# Altium schematic sheet Power_toll.SchDoc
size A2
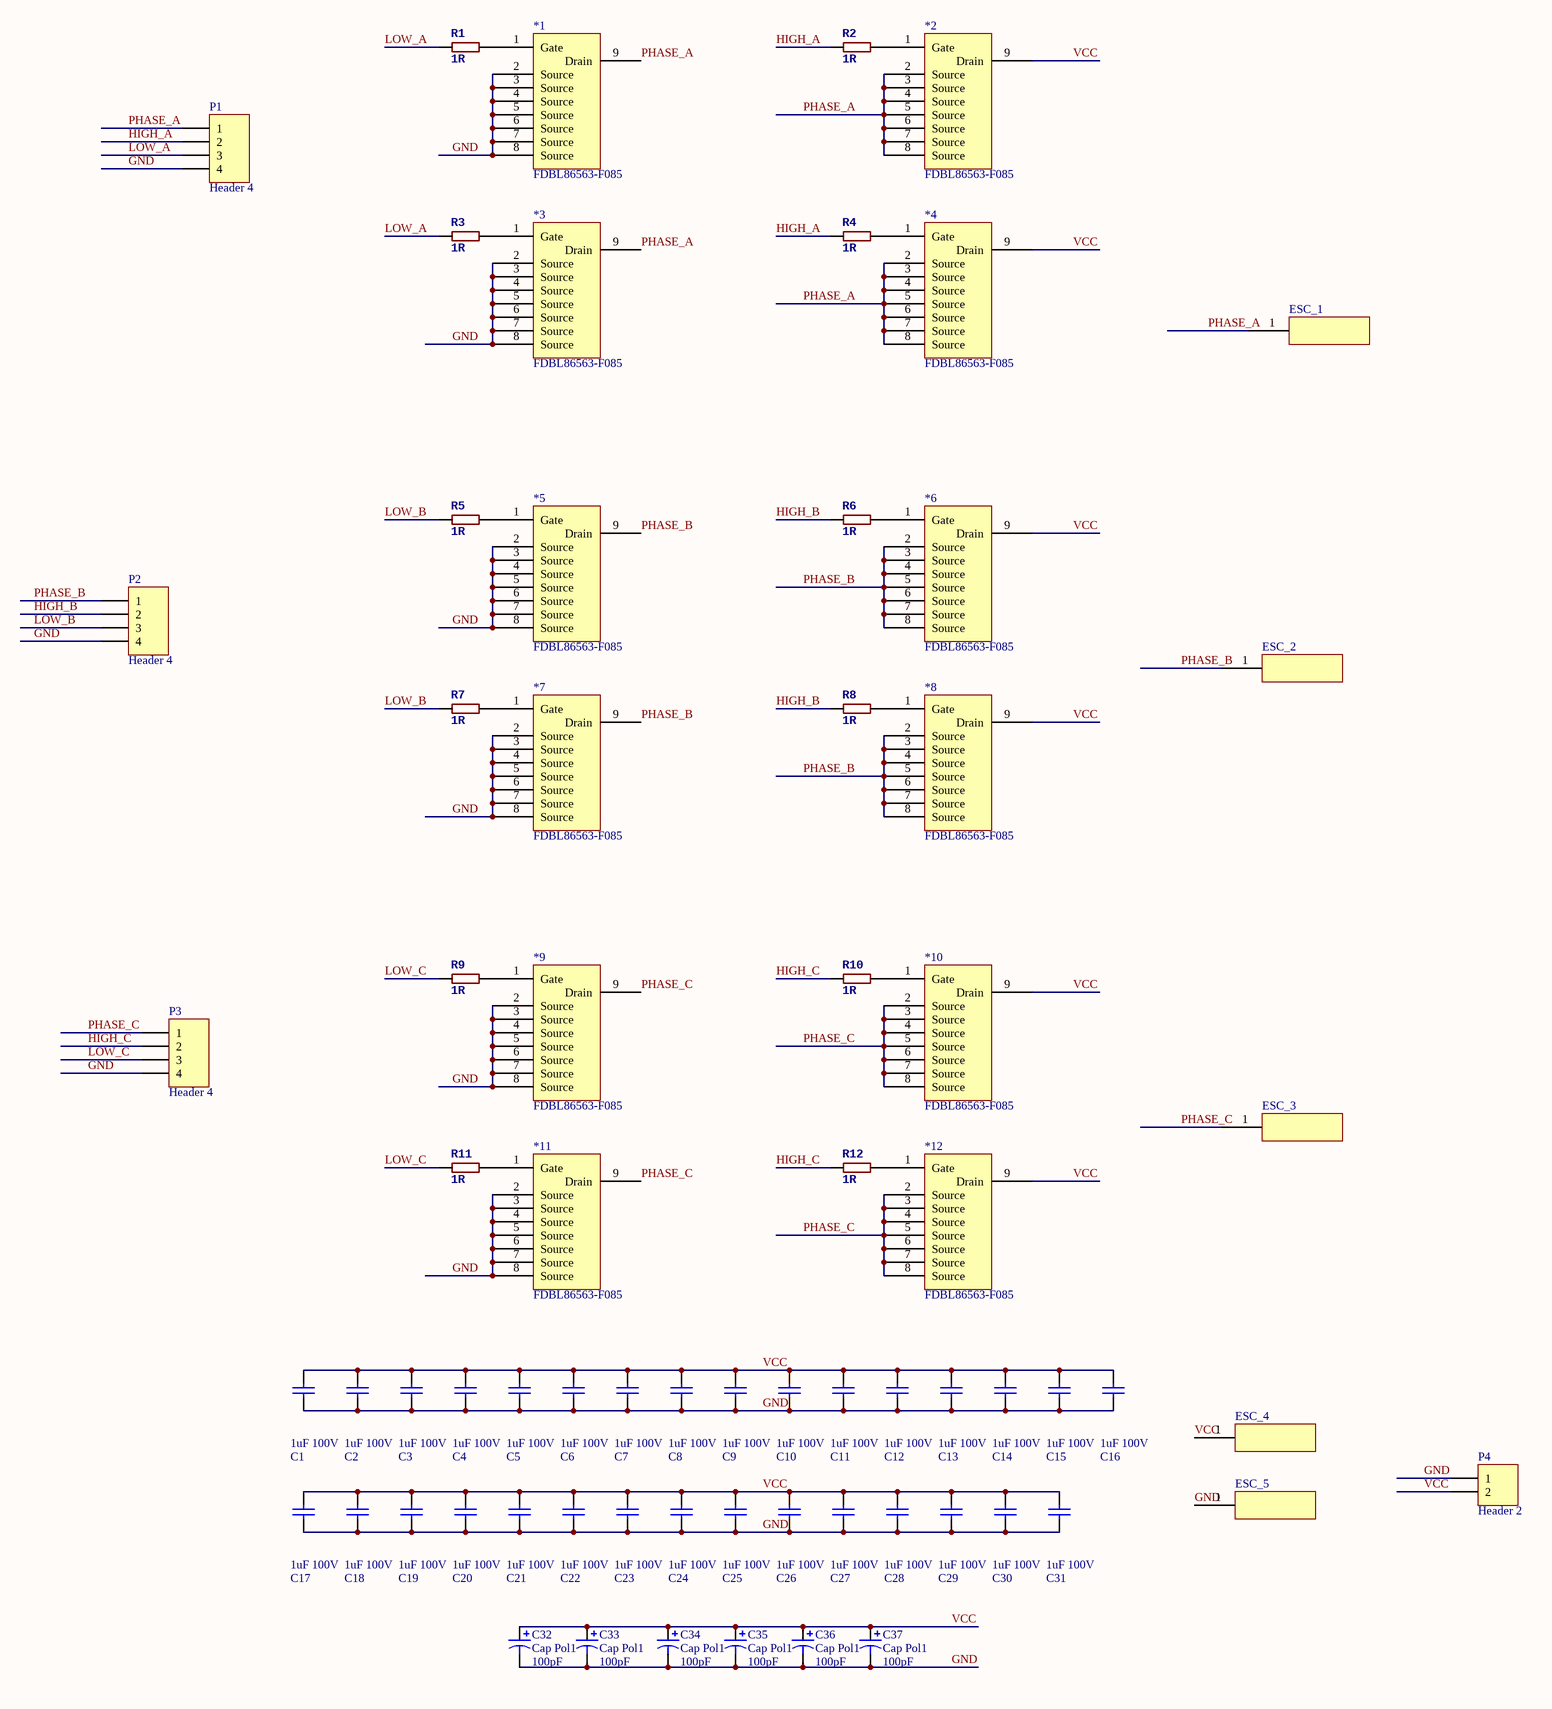
[diagram p0: Power_toll.SchDoc]

## Parts
*1  FDBL86563-F085  [FDBL86563-F085]
*2  FDBL86563-F085  [FDBL86563-F085]
*3  FDBL86563-F085  [FDBL86563-F085]
*4  FDBL86563-F085  [FDBL86563-F085]
*5  FDBL86563-F085  [FDBL86563-F085]
*6  FDBL86563-F085  [FDBL86563-F085]
*7  FDBL86563-F085  [FDBL86563-F085]
*8  FDBL86563-F085  [FDBL86563-F085]
*9  FDBL86563-F085  [FDBL86563-F085]
*10  FDBL86563-F085  [FDBL86563-F085]
*11  FDBL86563-F085  [FDBL86563-F085]
*12  FDBL86563-F085  [FDBL86563-F085]
C1  1uF 100V  [C1206]
C2  1uF 100V  [C1206]
C3  1uF 100V  [C1206]
C4  1uF 100V  [C1206]
C5  1uF 100V  [C1206]
C6  1uF 100V  [C1206]
C7  1uF 100V  [C1206]
C8  1uF 100V  [C1206]
C9  1uF 100V  [C1206]
C10  1uF 100V  [C1206]
C11  1uF 100V  [C1206]
C12  1uF 100V  [C1206]
C13  1uF 100V  [C1206]
C14  1uF 100V  [C1206]
C15  1uF 100V  [C1206]
C16  1uF 100V  [C1206]
C17  1uF 100V  [C1206]
C18  1uF 100V  [C1206]
C19  1uF 100V  [C1206]
C20  1uF 100V  [C1206]
C21  1uF 100V  [C1206]
C22  1uF 100V  [C1206]
C23  1uF 100V  [C1206]
C24  1uF 100V  [C1206]
C25  1uF 100V  [C1206]
C26  1uF 100V  [C1206]
C27  1uF 100V  [C1206]
C28  1uF 100V  [C1206]
C29  1uF 100V  [C1206]
C30  1uF 100V  [C1206]
C31  1uF 100V  [C1206]
C32  Cap Pol1  value 100pF  [RB5-10.5]
C33  Cap Pol1  value 100pF  [RB5-10.5]
C34  Cap Pol1  value 100pF  [RB5-10.5]
C35  Cap Pol1  value 100pF  [RB5-10.5]
C36  Cap Pol1  value 100pF  [RB5-10.5]
C37  Cap Pol1  value 100pF  [RB5-10.5]
ESC_1  Component_1  [power_terminal]  (value not drawn)
ESC_2  Component_1  [power_terminal]  (value not drawn)
ESC_3  Component_1  [power_terminal]  (value not drawn)
ESC_4  Component_1  [power_terminal]  (value not drawn)
ESC_5  Component_1  [power_terminal]  (value not drawn)
P1  Header 4  [HDR1X4]
P2  Header 4  [HDR1X4]
P3  Header 4  [HDR1X4]
P4  Header 2  [HDR1X2]
R1  1R  [1608[0603]]
R2  1R  [1608[0603]]
R3  1R  [1608[0603]]
R4  1R  [1608[0603]]
R5  1R  [1608[0603]]
R6  1R  [1608[0603]]
R7  1R  [1608[0603]]
R8  1R  [1608[0603]]
R9  1R  [1608[0603]]
R10  1R  [1608[0603]]
R11  1R  [1608[0603]]
R12  1R  [1608[0603]]

## Nets
GND: *1.2(Source) *1.3(Source) *1.4(Source) *1.5(Source) *1.6(Source) *1.7(Source) *1.8(Source) *3.2(Source) *3.3(Source) *3.4(Source) *3.5(Source) *3.6(Source) *3.7(Source) *3.8(Source) *5.2(Source) *5.3(Source) *5.4(Source) *5.5(Source) *5.6(Source) *5.7(Source) *5.8(Source) *7.2(Source) *7.3(Source) *7.4(Source) *7.5(Source) *7.6(Source) *7.7(Source) *7.8(Source) *9.2(Source) *9.3(Source) *9.4(Source) *9.5(Source) *9.6(Source) *9.7(Source) *9.8(Source) *11.2(Source) *11.3(Source) *11.4(Source) *11.5(Source) *11.6(Source) *11.7(Source) *11.8(Source) C1.1 C2.1 C3.1 C4.1 C5.1 C6.1 C7.1 C8.1 C9.1 C10.1 C11.1 C12.1 C13.1 C14.1 C15.1 C16.1 C17.1 C18.1 C19.1 C20.1 C21.1 C22.1 C23.1 C24.1 C25.1 C26.1 C27.1 C28.1 C29.1 C30.1 C31.1 C32.2 C33.2 C34.2 C35.2 C36.2 C37.2 ESC_5.1 P1.4 P2.4 P3.4 P4.1
HIGH_A: P1.2 R2.2 R4.2
HIGH_B: P2.2 R6.2 R8.2
HIGH_C: P3.2 R10.2 R12.2
LOW_A: P1.3 R1.2 R3.2
LOW_B: P2.3 R5.2 R7.2
LOW_C: P3.3 R9.2 R11.2
PHASE_A: *1.9(Drain) *2.2(Source) *2.3(Source) *2.4(Source) *2.5(Source) *2.6(Source) *2.7(Source) *2.8(Source) *3.9(Drain) *4.2(Source) *4.3(Source) *4.4(Source) *4.5(Source) *4.6(Source) *4.7(Source) *4.8(Source) ESC_1.1 P1.1
PHASE_B: *5.9(Drain) *6.2(Source) *6.3(Source) *6.4(Source) *6.5(Source) *6.6(Source) *6.7(Source) *6.8(Source) *7.9(Drain) *8.2(Source) *8.3(Source) *8.4(Source) *8.5(Source) *8.6(Source) *8.7(Source) *8.8(Source) ESC_2.1 P2.1
PHASE_C: *9.9(Drain) *10.2(Source) *10.3(Source) *10.4(Source) *10.5(Source) *10.6(Source) *10.7(Source) *10.8(Source) *11.9(Drain) *12.2(Source) *12.3(Source) *12.4(Source) *12.5(Source) *12.6(Source) *12.7(Source) *12.8(Source) ESC_3.1 P3.1
VCC: *2.9(Drain) *4.9(Drain) *6.9(Drain) *8.9(Drain) *10.9(Drain) *12.9(Drain) C1.2 C2.2 C3.2 C4.2 C5.2 C6.2 C7.2 C8.2 C9.2 C10.2 C11.2 C12.2 C13.2 C14.2 C15.2 C16.2 C17.2 C18.2 C19.2 C20.2 C21.2 C22.2 C23.2 C24.2 C25.2 C26.2 C27.2 C28.2 C29.2 C30.2 C31.2 C32.1 C33.1 C34.1 C35.1 C36.1 C37.1 ESC_4.1 P4.2
Net*1_1: *1.1(Gate) R1.1
Net*2_1: *2.1(Gate) R2.1
Net*3_1: *3.1(Gate) R3.1
Net*4_1: *4.1(Gate) R4.1
Net*5_1: *5.1(Gate) R5.1
Net*6_1: *6.1(Gate) R6.1
Net*7_1: *7.1(Gate) R7.1
Net*8_1: *8.1(Gate) R8.1
Net*9_1: *9.1(Gate) R9.1
Net*10_1: *10.1(Gate) R10.1
Net*11_1: *11.1(Gate) R11.1
Net*12_1: *12.1(Gate) R12.1

## Library data of the parts
C1-C31 = Cap Semi: Capacitor (Semiconductor SIM Model); Published: 8-Jun-2000; LatestRevisionDate: 29-May-2009; LatestRevisionNote: IPC-7351 Footprint Added.; PackageReference: C1206; Publisher: Altium Limited; PackageDescription: Chip Capacitor; Value: 1uF 100V
C32-C37 = Cap Pol1: Polarized Capacitor (Radial); Published: 8-Jun-2000; LatestRevisionDate: 17-Jul-2002; LatestRevisionNote: Re-released for DXP Platform.; PackageReference: RB7.6-15; Publisher: Altium Limited; PackageDescription: Polarized Capacitor (Radial); 2 Leads
P1-P3 = Header 4: Header, 4-Pin; LatestRevisionDate: 17-Jul-2002; LatestRevisionNote: Re-released for DXP Platform.; Publisher: Altium Limited
P4 = Header 2: Header, 2-Pin; LatestRevisionDate: 17-Jul-2002; LatestRevisionNote: Re-released for DXP Platform.; Publisher: Altium Limited
R1-R12 = R0402